# Altium schematic sheet Top.SchDoc: Top-Level
size Letter; Organization: Altium Limited; Address1: L3, 12a Rodborough Rd; Address2: Frenchs Forest; Address3: NSW; Address4: Australia 2086; DocumentNumber: 4; Revision: 1; SheetNumber: 1; SheetTotal: 3
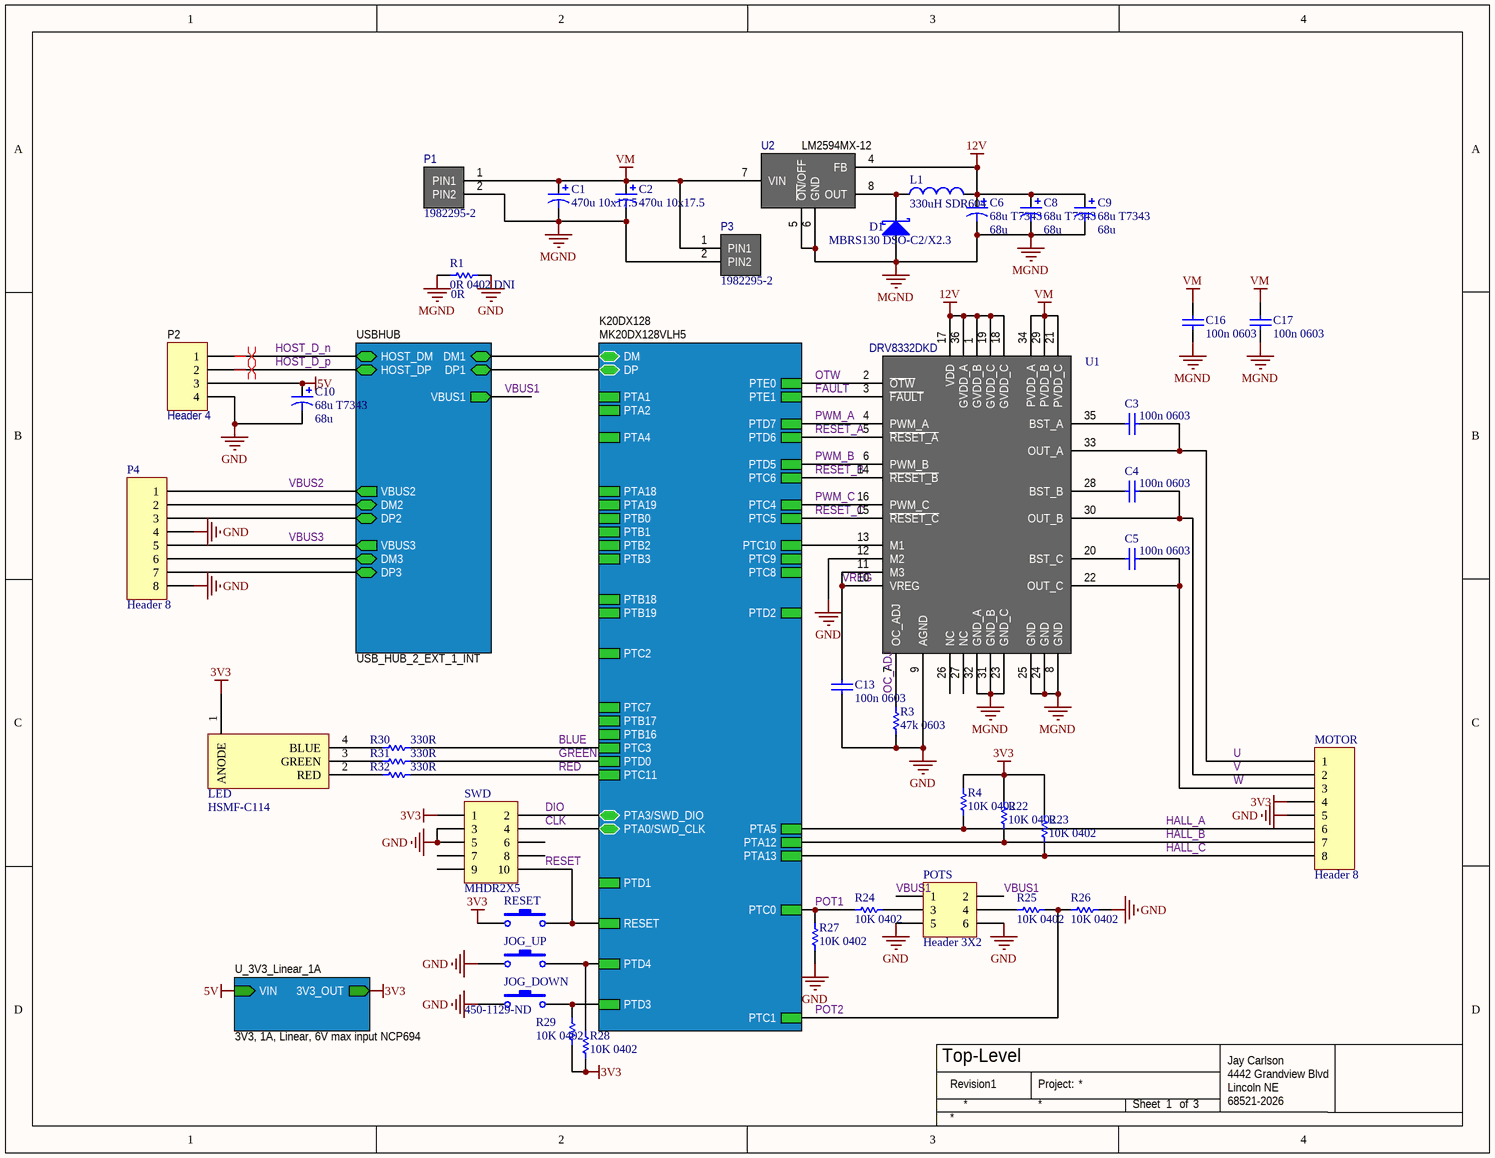
[diagram p0: Top.SchDoc]

## Parts
C1  470u 10x17.5  [CAPPR5-10x17.5]
C2  470u 10x17.5  [CAPPR5-10x17.5]
C3  100n 0603  [CAPC1608N]
C4  100n 0603  [CAPC1608N]
C5  100n 0603  [CAPC1608N]
C6  68u T7343  value 68u  [TC7343-2917]
C8  68u T7343  value 68u  [TC7343-2917]
C9  68u T7343  value 68u  [TC7343-2917]
C10  68u T7343  value 68u  [TC7343-2917]
C13  100n 0603  [CAPC1608N]
C16  100n 0603  [CAPC1608N]
C17  100n 0603  [CAPC1608N]
D1  MBRS130 DSO-C2/X2.3  [DSO-C2/X2.3]
JOG_DOWN  Supplier Part Number 1: 450-1129-ND  [SW/PB-SMD/H8]  (hidden comment: SW-PB)
JOG_UP  SW-PB  [SW/PB-SMD/H8]  (value not drawn)
L1  330uH SDR604  [SDR604]
LED  HSMF-C114  [HSMF-C114]
MOTOR  Header 8  [7-215079-8]
P1  1982295-2  [1982295-2]
P2  Header 4  [USB2.5-2H4D]
P3  1982295-2  [1982295-2]
P4  Header 8  [USB2.5-4H8]
POTS  Header 3X2  [HDR2X3]
R1  0R 0402 DNI  value 0R  [RESC1005N]
R3  47k 0603  [RESC1608N]
R4  10K 0402  [RESC1005N]
R22  10K 0402  [RESC1005N]
R23  10K 0402  [RESC1005N]
R24  10K 0402  [RESC1005N]
R25  10K 0402  [RESC1005N]
R26  10K 0402  [RESC1005N]
R27  10K 0402  [RESC1005N]
R28  10K 0402  [RESC1005N]
R29  10K 0402  [RESC1005N]
R30  value 330R  [RESC1005N]  (hidden comment: 330R 0402)
R31  value 330R  [RESC1005N]  (hidden comment: 330R 0402)
R32  value 330R  [RESC1005N]  (hidden comment: 330R 0402)
RESET  SW-PB  [SW/PB-SMD/H8]  (value not drawn)
SWD  MHDR2X5  [MHDR2X5]
U1  DRV8332DKD  [DKD36]
U2  LM2594MX-12  [SOIC127P600-8CN]

## Sub-sheets
K20DX128 = MK20DX128VLH5: PTA1, PTA2, PTA4, PTA5, PTA12, PTA13, PTA18, PTA19, PTB0, PTB1, PTB2, PTB3, PTB16, PTB17, PTB18, PTB19, PTC0, PTC1, PTC2, PTC3, PTC4, PTC5, PTC6, PTC7, PTC8, PTC9, PTC10, PTC11, PTD0, PTD1, PTD2, PTD3, PTD4, PTD5, PTD6, PTD7, PTE0, PTE1, RESET, PTA0/SWD_CLK, PTA3/SWD_DIO, DM (bidir), DP (bidir)
U_3V3_Linear_1A = 3V3, 1A, Linear, 6V max input NCP694: VIN (in), 3V3_OUT (out)
USBHUB = USB_HUB_2_EXT_1_INT: DM1 (bidir), DM2 (bidir), DM3 (bidir), DP1 (bidir), DP2 (bidir), DP3 (bidir), VBUS1 (out), VBUS2 (out), VBUS3 (out), HOST_DM (bidir), HOST_DP (bidir)

## Nets
3V3: LED.1(ANODE) MOTOR.4 R4.1 R22.1 R23.1 R28.2 R29.2 RESET.1 SWD.1 ; sheet U_3V3_Linear_1A/3V3_OUT
5V: C10.1 P2.3 ; sheet U_3V3_Linear_1A/VIN
12V: C6.1 C8.1 C9.1 L1.2 U1.1(GVDD_B) U1.17(VDD) U1.18(GVDD_C) U1.19(GVDD_C) U1.36(GVDD_A) U2.4(FB)
GND: C10.2 C13.2 JOG_DOWN.1 JOG_UP.1 MOTOR.5 P2.4 P4.4 P4.8 POTS.5 POTS.6 R1.1 R3.2 R26.2 R27.2 SWD.3 SWD.5 U1.9(AGND) U1.12(M2)
MGND: C1.2 C2.2 C6.2 C8.2 C9.2 C16.2 C17.2 D1.1(A) P1.2(PIN2) P3.2(PIN2) R1.2 U1.8(GND) U1.23(GND_C) U1.24(GND) U1.25(GND) U1.31(GND_B) U1.32(GND_A) U2.5(~{ON}/OFF) U2.6(GND)
VM: C1.1 C2.1 C16.1 C17.1 P1.1(PIN1) P3.1(PIN1) U1.21(PVDD_C) U1.29(PVDD_B) U1.34(PVDD_A) U2.7(VIN)
BLUE: R30.2 ; sheet K20DX128/PTC3
CLK: SWD.4 ; sheet K20DX128/PTA0/SWD_CLK
DIO: SWD.2 ; sheet K20DX128/PTA3/SWD_DIO
FAULT: U1.3(~{FAULT}) ; sheet K20DX128/PTE1
GREEN: R31.2 ; sheet K20DX128/PTD0
HALL_A: MOTOR.6 R4.2 ; sheet K20DX128/PTA5
HALL_B: MOTOR.7 R22.2 ; sheet K20DX128/PTA12
HALL_C: MOTOR.8 R23.2 ; sheet K20DX128/PTA13
HOST_D_n: P2.1 ; sheet USBHUB/HOST_DM
HOST_D_p: P2.2 ; sheet USBHUB/HOST_DP
OC_ADJ: R3.1 U1.7(OC_ADJ)
OTW: U1.2(~{OTW}) ; sheet K20DX128/PTE0
POT1: R24.1 R27.1 ; sheet K20DX128/PTC0
POT2: R25.1 R26.1 ; sheet K20DX128/PTC1
PWM_A: U1.4(PWM_A) ; sheet K20DX128/PTD7
PWM_B: U1.6(PWM_B) ; sheet K20DX128/PTD5
PWM_C: U1.16(PWM_C) ; sheet K20DX128/PTC4
RED: R32.2 ; sheet K20DX128/PTC11
RESET: RESET.2 SWD.10 ; sheet K20DX128/RESET
RESET_A: U1.5(~{RESET_A}) ; sheet K20DX128/PTD6
RESET_B: U1.14(~{RESET_B}) ; sheet K20DX128/PTC6
RESET_C: U1.15(~{RESET_C}) ; sheet K20DX128/PTC5
U: C3.1 MOTOR.1 U1.33(OUT_A)
V: C4.1 MOTOR.2 U1.30(OUT_B)
VBUS1: POTS.1 POTS.2 ; sheet USBHUB/VBUS1
VBUS2: P4.1 ; sheet USBHUB/VBUS2
VBUS3: P4.5 ; sheet USBHUB/VBUS3
VREG: C13.1 U1.10(VREG) U1.11(M3)
W: C5.1 MOTOR.3 U1.22(OUT_C)
NetC3_2: C3.2 U1.35(BST_A)
NetC4_2: C4.2 U1.28(BST_B)
NetC5_2: C5.2 U1.20(BST_C)
NetD1_2: D1.2(K) L1.1 U2.8(OUT)
NetJOG_DOWN_2: JOG_DOWN.2 R29.1 ; sheet K20DX128/PTD3
NetJOG_UP_2: JOG_UP.2 R28.1 ; sheet K20DX128/PTD4
NetLED_2: LED.2(RED) R32.1
NetLED_3: LED.3(GREEN) R31.1
NetLED_4: LED.4(BLUE) R30.1
NetP4_2: P4.2 ; sheet USBHUB/DM2
NetP4_3: P4.3 ; sheet USBHUB/DP2
NetP4_6: P4.6 ; sheet USBHUB/DM3
NetP4_7: P4.7 ; sheet USBHUB/DP3
NetPOTS_3: POTS.3 R24.2
NetPOTS_4: POTS.4 R25.2
NetU1_13: U1.13(M1) ; sheet K20DX128/PTC10
(unnamed): sheet K20DX128/DM, sheet USBHUB/DM1
(unnamed): sheet K20DX128/DP, sheet USBHUB/DP1

Not connected (* = marked no-connect by the designer): SWD 6 7 8 9; U1 26(NC) 27(NC)

## Layout directives
differential pair: HOST_D_n, HOST_D_p

## Notes on the sheet
- Revision
- Project:
- Sheet
- of
- Jay Carlson
  4442 Grandview Blvd
  Lincoln NE 68521-2026

## Library data of the parts
C1 C2 C6 C8-C10 = Cap Pol1: Polarized Capacitor (Radial); Published: 8-Jun-2000; LatestRevisionDate: 17-Jul-2002; LatestRevisionNote: Re-released for DXP Platform.; PackageReference: RB7.6-15; Publisher: Altium Limited; PackageDescription: Polarized Capacitor (Radial); 2 Leads
  C6 C8-C10: Supplier 1: Digi-Key; Supplier Part Number 1: 495-1561-1-ND
C3-C5 C13 C16 C17 = Cap: Capacitor; Published: 8-Jun-2000; LatestRevisionDate: 17-Jul-2002; LatestRevisionNote: Re-released for DXP Platform.; PackageReference: RAD-0.3; Publisher: Altium Limited; PackageDescription: Radial Cap, Thru-Hole; 2 Leads; 0.3 in Pin Spacing
D1 = D Schottky: Schottky Diode; Published: 8-Jun-2000; LatestRevisionDate: 17-Jul-2002; LatestRevisionNote: Re-released for DXP Platform.; PackageReference: SMB; Publisher: Altium Limited; PackageDescription: DO-214-AA/SMB; 2 C-Bend Leads; Body 5.3 x 3.6 mm, inc. leads (LxW); Code_JEDEC: DO-214-AA; Supplier 1: Digi-Key; Supplier Part Number 1: MBRS130FSCT-ND
JOG_DOWN JOG_UP RESET = SW-PB: Switch; Published: 24-Mar-1999; LatestRevisionDate: 17-Jul-2002; LatestRevisionNote: Re-released for DXP Platform.; PackageReference: SPST-2; Publisher: Altium Limited; PackageDescription: Switch; 2 Leads; Supplier 1: Digi-Key
  JOG_UP RESET: Supplier Part Number 1: 450-1129-ND
L1 = Inductor: Code_IEC: 1005; Value: 330u; Published: 8-Jun-2000; LatestRevisionDate: 29-May-2009; LatestRevisionNote: IPC-7351 Footprint Added.; PackageReference: 0402-A; Publisher: Altium Limited; PackageDescription: Chip Inductor; Code_JEITA: 0402; Supplier 1: Digi-Key; Supplier Part Number 1: SDR0604-331KLCT-ND
LED = HSMF-C114: LED CHIP RGB 1.6X1.5X0.35MM SMD; Manufacturer: Avago Technologies US Inc.; Millicandela Rating: 85mcd Red, 180mcd Green, 70mcd Blue; Voltage - Forward (Vf) Typ: 1.9V Red, 3.4V Green, 3.4V Blue; Current - Test: 20mA; Wavelength - Dominant: 626nm, 525nm, 470nm; Wavelength - Peak: 637nm, 523nm, 468nm; Viewing Angle: 140°, 145°, 145°; Lens Type: Diffused; Lens Style/Size: Rectangle with Flat Top, 1.5mm x 1.1mm; Supplier 1: Digi-Key; Supplier Part Number 1: 516-1795-1-ND; Manufacturer Part Number: HSMF-C114; RoHS: RoHS Compliant; Category: Optoelectronics; Stock 1: 12490; Pricing 1: 1=2.03, 10=1.62, 100=1.125, 250=0.99, 500=0.8325, 1000=0.675 (USD); Color: Red, Green, Blue (RGB); Package / Case: 0606 (1616 Metric); Size / Dimension: 1.60mm L x 1.50mm W; Height: 0.35mm; Mounting Type: Surface Mount; Packaging: Cut Tape (CT); Luminous Flux @ Current - Test: -; ComponentLink1URL: http://www.avagotech.com/docs/AV02-2451EN; ComponentLink1Description: http://www.avagotech.com/docs/AV02-2451EN
MOTOR P4 = Header 8: Header, 8-Pin; LatestRevisionDate: 17-Jul-2002; LatestRevisionNote: Re-released for DXP Platform.; Publisher: Altium Limited
P2 = Header 4: Header, 4-Pin; LatestRevisionDate: 17-Jul-2002; LatestRevisionNote: Re-released for DXP Platform.; Publisher: Altium Limited
POTS = Header 3X2: Header, 3-Pin, Dual row; LatestRevisionDate: 17-Jul-2002; LatestRevisionNote: Re-released for DXP Platform.; Publisher: Altium Limited
R1 R3 R4 R22-R32 = Res Semi: Semiconductor Resistor; Published: 8-Jun-2000; LatestRevisionDate: 17-Jul-2002; LatestRevisionNote: Re-released for DXP Platform.; PackageReference: AXIAL-0.5; Publisher: Altium Limited; PackageDescription: Axial Device, Thru-Hole; 2 Leads; 0.5 in Pin Spacing
  R4 R22-R29: Value: 10k
SWD = MHDR2X5: Header, 5-Pin, Dual row; LatestRevisionDate: 17-Jul-2002; LatestRevisionNote: Re-released for DXP Platform.; Publisher: Altium Limited
U2 = LM2594MX-12: Supplier 1: Digi-Key; Supplier Part Number 1: LM2594M-12/NOPB-ND